# EAGLE design me433_2017 (EAGLE 8.1.0)
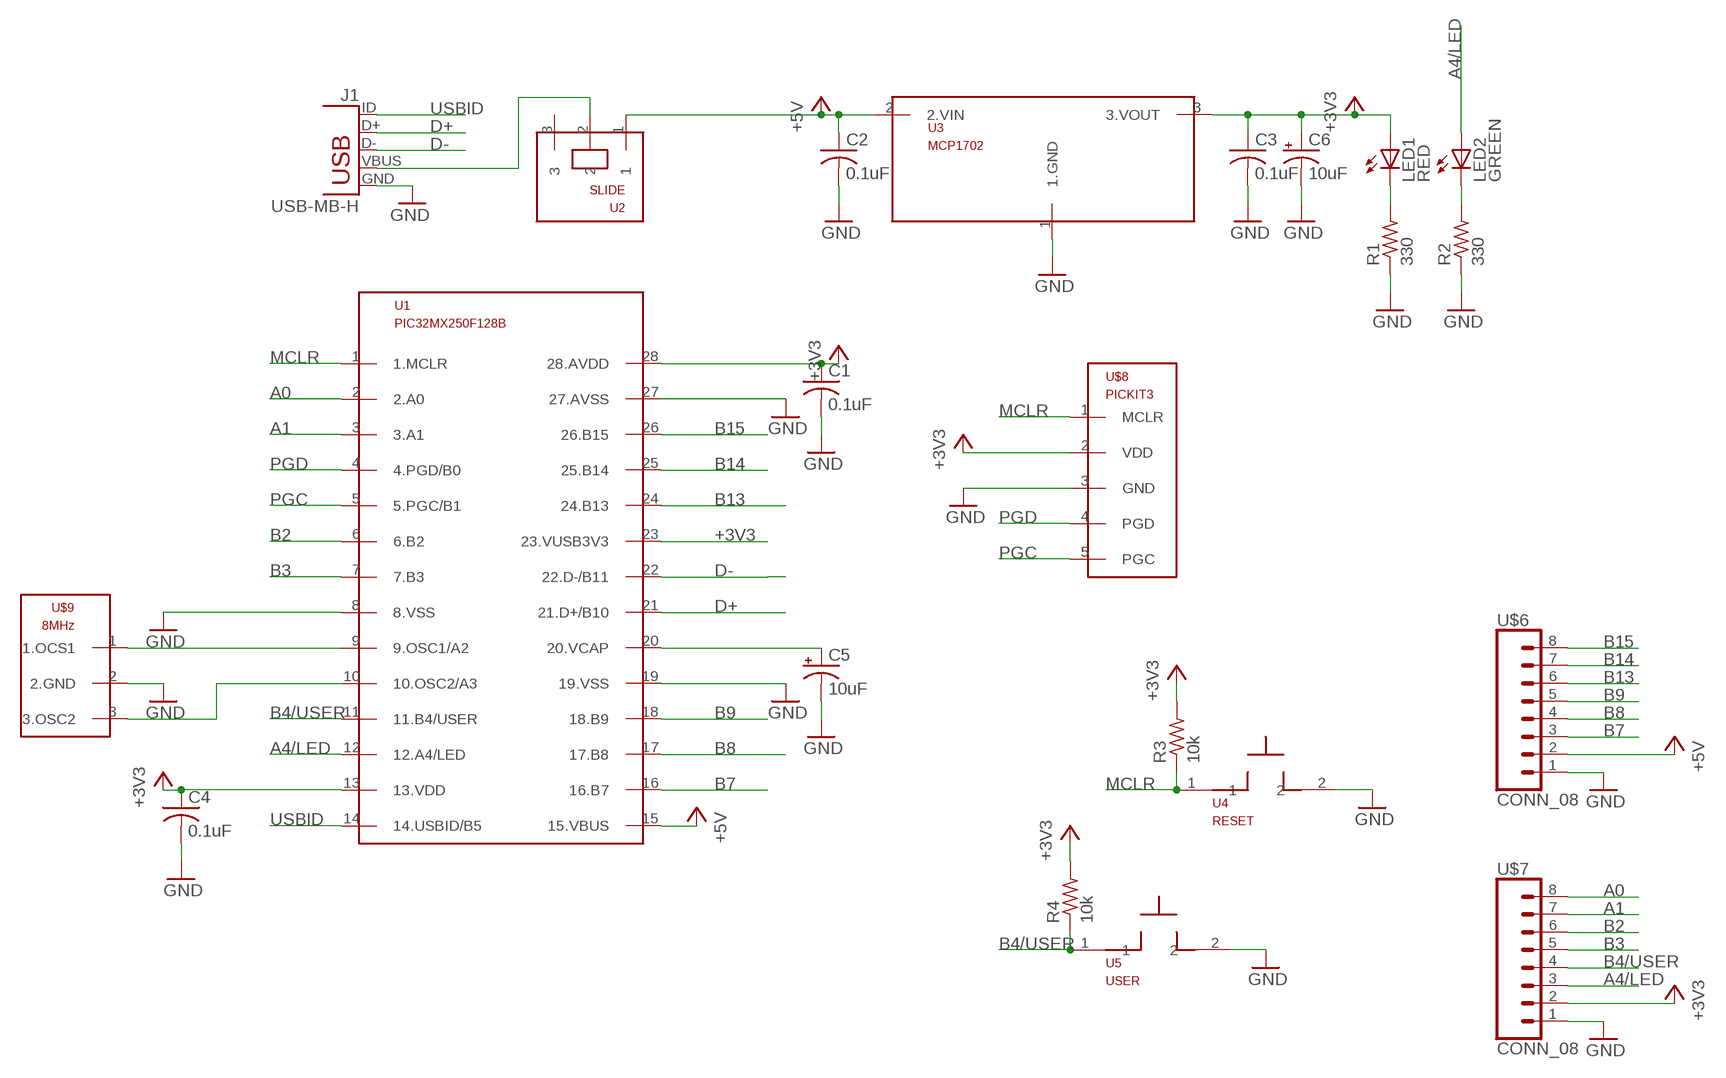
[diagram p0: schematic, sheet 1]

## Parts
C1  0.1uF  C-US025-025X050  [C025-025X050]
C2  0.1uF  C-US025-025X050  [C025-025X050]
C3  0.1uF  C-US025-025X050  [C025-025X050]
C4  0.1uF  C-US025-025X050  [C025-025X050]
C5  10uF  CPOL-USB45181B  [B45181B]
C6  10uF  CPOL-USB45181B  [B45181B]
J1  USB-MB-H  [USB-MB-H]
LED1  RED  LED3MM  [LED3MM]
LED2  GREEN  LED3MM  [LED3MM]
R1  330  R-US_0207/10  [0207/10]
R2  330  R-US_0207/10  [0207/10]
R3  10k  R-US_0207/10  [0207/10]
R4  10k  R-US_0207/10  [0207/10]
U1  PIC32MX250F128B  [DIL28-3]
U2  SLIDE  [SLIDE]
U3  MCP1702  [TO92]
U4  RESET  PB  [PB]
U5  USER  PB  [PB]
U$6  CONN_08  [1X08]
U$7  CONN_08  [1X08]
U$8  PICKIT3  [1X05]
U$9  8MHz  OSC  [OSC]

## Nets
+3V3: C1.1 C3.1 C4.1 C6.+ LED1.A R3.2 R4.2 U1.13(13.VDD) U1.23(23.VUSB3V3) U1.28(28.AVDD) U3.3(3.VOUT) U$7.2 U$8.2(VDD)
+5V: C2.1 U1.15(15.VBUS) U2.1 U3.2(2.VIN) U$6.2
A0: U1.2(2.A0) U$7.8
A1: U1.3(3.A1) U$7.7
A4/LED: LED2.A U1.12(12.A4/LED) U$7.3
B2: U1.6(6.B2) U$7.6
B3: U1.7(7.B3) U$7.5
B4/USER: R4.1 U1.11(11.B4/USER) U5.1 U$7.4
B7: U1.16(16.B7) U$6.3
B8: U1.17(17.B8) U$6.4
B9: U1.18(18.B9) U$6.5
B13: U1.24(24.B13) U$6.6
B14: U1.25(25.B14) U$6.7
B15: U1.26(26.B15) U$6.8
D+: J1.D+ U1.21(21.D+/B10)
D-: J1.D- U1.22(22.D-/B11)
GND: C1.2 C2.2 C3.2 C4.2 C5.- C6.- J1.GND R1.1 R2.1 U1.8(8.VSS) U1.19(19.VSS) U1.27(27.AVSS) U3.1(1.GND) U4.2 U5.2 U$6.1 U$7.1 U$8.3(GND) U$9.2(2.GND)
MCLR: R3.1 U1.1(1.MCLR) U4.1 U$8.1(MCLR)
N$1: J1.VBUS U2.2
N$2: U1.9(9.OSC1/A2) U$9.1(1.OCS1)
N$3: LED1.K(C) R1.2
N$4: LED2.K(C) R2.2
N$5: U1.10(10.OSC2/A3) U$9.3(3.OSC2)
N$6: C5.+ U1.20(20.VCAP)
PGC: U1.5(5.PGC/B1) U$8.5(PGC)
PGD: U1.4(4.PGD/B0) U$8.4(PGD)
USBID: J1.ID U1.14(14.USBID/B5)
Unconnected: U2.3

## Library data of the parts
C1-C4 = resistor:C-US: CAPACITOR, American symbol
C5 C6 = resistor:CPOL-US: POLARIZED CAPACITOR, American symbol
J1 = me433_2017:USB: USB Connectors USB-B-PTH is fully proven SKU : PRT-00139/CONN-08278 USB-miniB is fully proven SKU : PRT-00587 USB-A-PCB is untested. USB-A-H is throughly reviewed, but untested. Spark Fun Electronics SKU : PRT-00437 USB-B-SMT is throughly reviewed, but untested. Needs silkscreen touching up. USB-A-S has not been used/tested USB-MB-H has not been used/tested USB-MICROB has been used. CONN-09505
LED1 LED2 = led:LED: LED OSRAM: - CHIPLED LG R971, LG N971, LY N971, LG Q971, LY Q971, LO R971, LY R971 LH N974, LH R974 LS Q976, LO Q976, LY Q976 LO Q996 - Hyper CHIPLED LW Q18S LB Q993, LB Q99A, LB R99A - SideLED LS A670, LO A670, LY A670, LG A670, LP A670 LB A673, LV A673, LT A673, LW A673 LH A674 LY A675 LS A676, LA A676, LO A676, LY A676, LW A676 LS A679, LY A679, LG A679 - Hyper Micro SIDELED® LS Y876, LA Y876, LO Y876, LY Y876 LT Y87S - SmartLED LW L88C, LW L88S LB L89C, LB L89S, LG L890 LS L89K, LO L89K, LY L89K LS L896, LA L896, LO L896, LY L896 - TOPLED LS T670, LO T670, LY T670, LG T670, LP T670 LSG T670, LSP T670, LSY T670, LOP T670, LYG T670 LG T671, LOG T671, LSG T671 LB T673, LV T673, LT T673, LW T673 LH T674 LS T676, LA T676, LO T676, LY T676, LB T676, LH T676, LSB T676, LW T676 LB T67C, LV T67C, LT T67C, LS T67K, LO T67K, LY T67K, LW E67C LS E67B, LA E67B, LO E67B, LY E67B, LB E67C, LV E67C, LT E67C LW T67C LS T679, LY T679, LG T679 LS T770, LO T770, LY T770, LG T770, LP T770 LB T773, LV T773, LT T773, LW T773 LH T774 LS E675, LA E675, LY E675, LS T675 LS T776, LA T776, LO T776, LY T776, LB T776 LHGB T686 LT T68C, LB T68C - Hyper Mini TOPLED® LB M676 - Mini TOPLED Santana® LG M470 LS M47K, LO M47K, LY M47K Source: http://www.osram.convergy.de LUXEON: - LUMILED® LXK2-PW12-R00, LXK2-PW12-S00, LXK2-PW14-U00, LXK2-PW14-V00 LXK2-PM12-R00, LXK2-PM12-S00, LXK2-PM14-U00 LXK2-PE12-Q00, LXK2-PE12-R00, LXK2-PE12-S00, LXK2-PE14-T00, LXK2-PE14-U00 LXK2-PB12-K00, LXK2-PB12-L00, LXK2-PB12-M00, LXK2-PB14-N00, LXK2-PB14-P00, LXK2-PB14-Q00 LXK2-PR12-L00, LXK2-PR12-M00, LXK2-PR14-Q00, LXK2-PR14-R00 LXK2-PD12-Q00, LXK2-PD12-R00, LXK2-PD12-S00 LXK2-PH12-R00, LXK2-PH12-S00 LXK2-PL12-P00, LXK2-PL12-Q00, LXK2-PL12-R00 Source: www.luxeon.com KINGBRIGHT: KA-3528ASYC Source: www.kingbright.com
R1-R4 = resistor:R-US_: RESISTOR, American symbol
U1 = me433_2017:PIC32MX250F128B
U2 = me433_2017:SLIDE
U3 = me433_2017:MCP1702
U4 U5 = me433_2017:PB
U$6 U$7 = me433_2017:CONN_08
U$8 = me433_2017:PICKIT3
U$9 = me433_2017:OSC

## Board
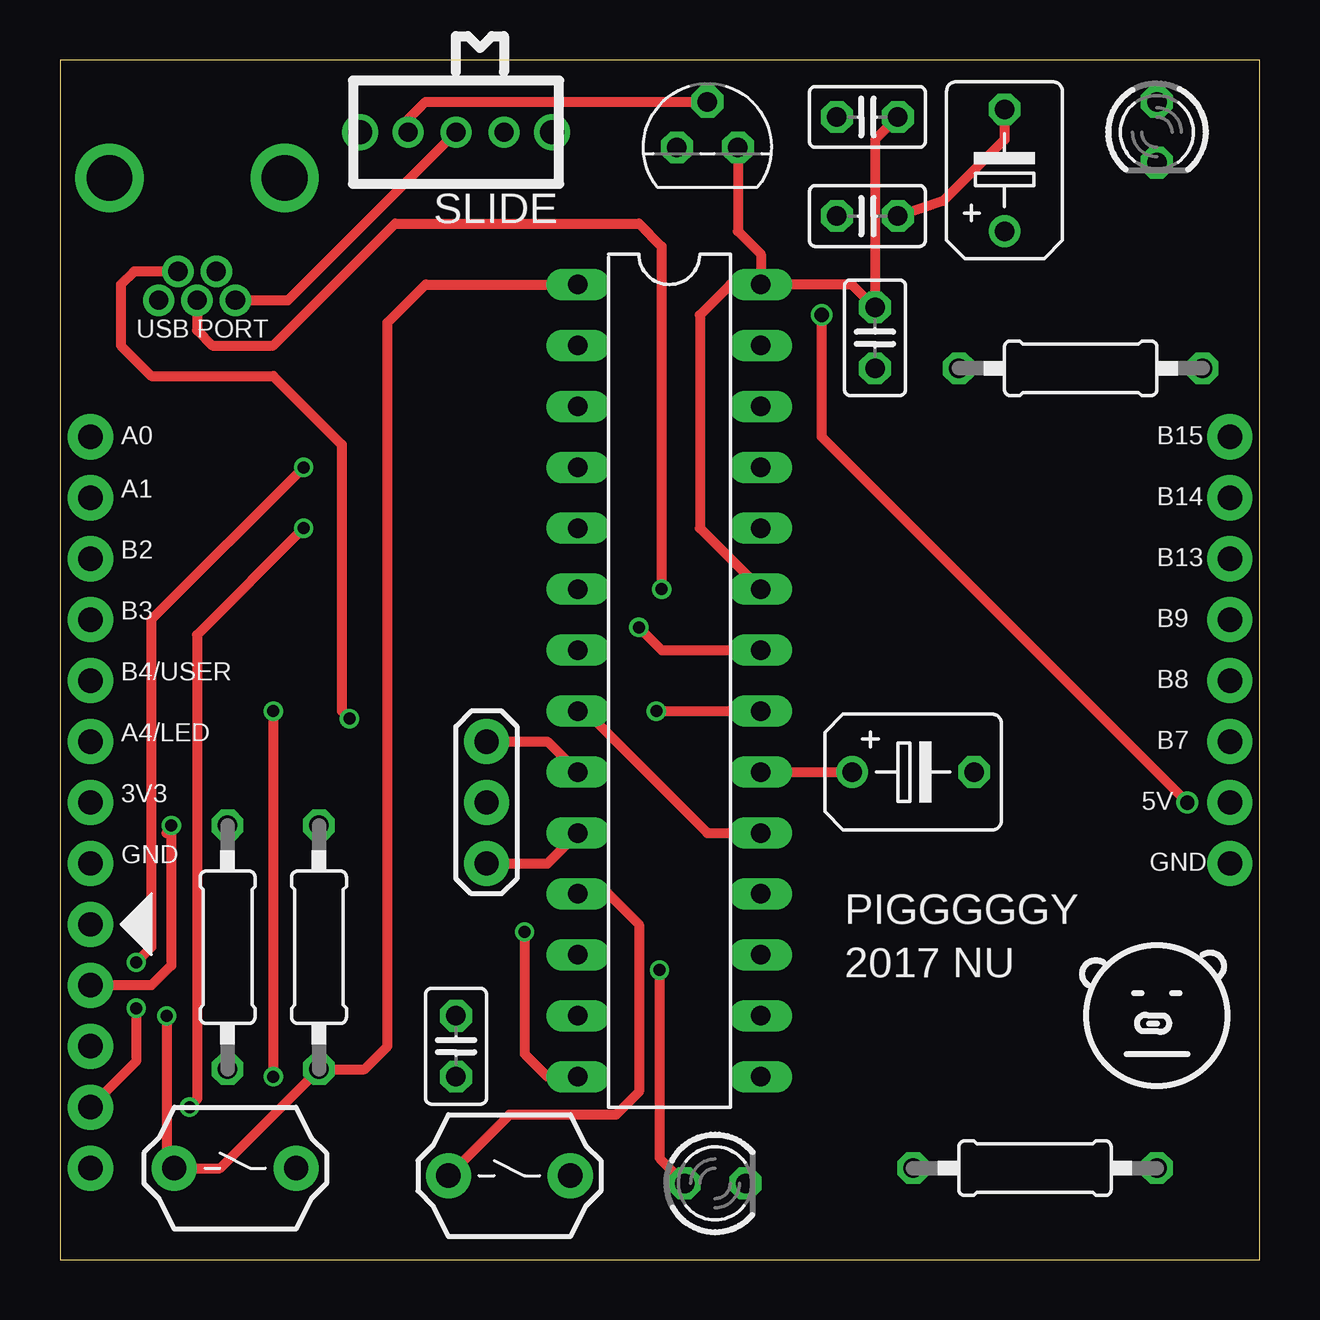
[diagram p1: board, top side]
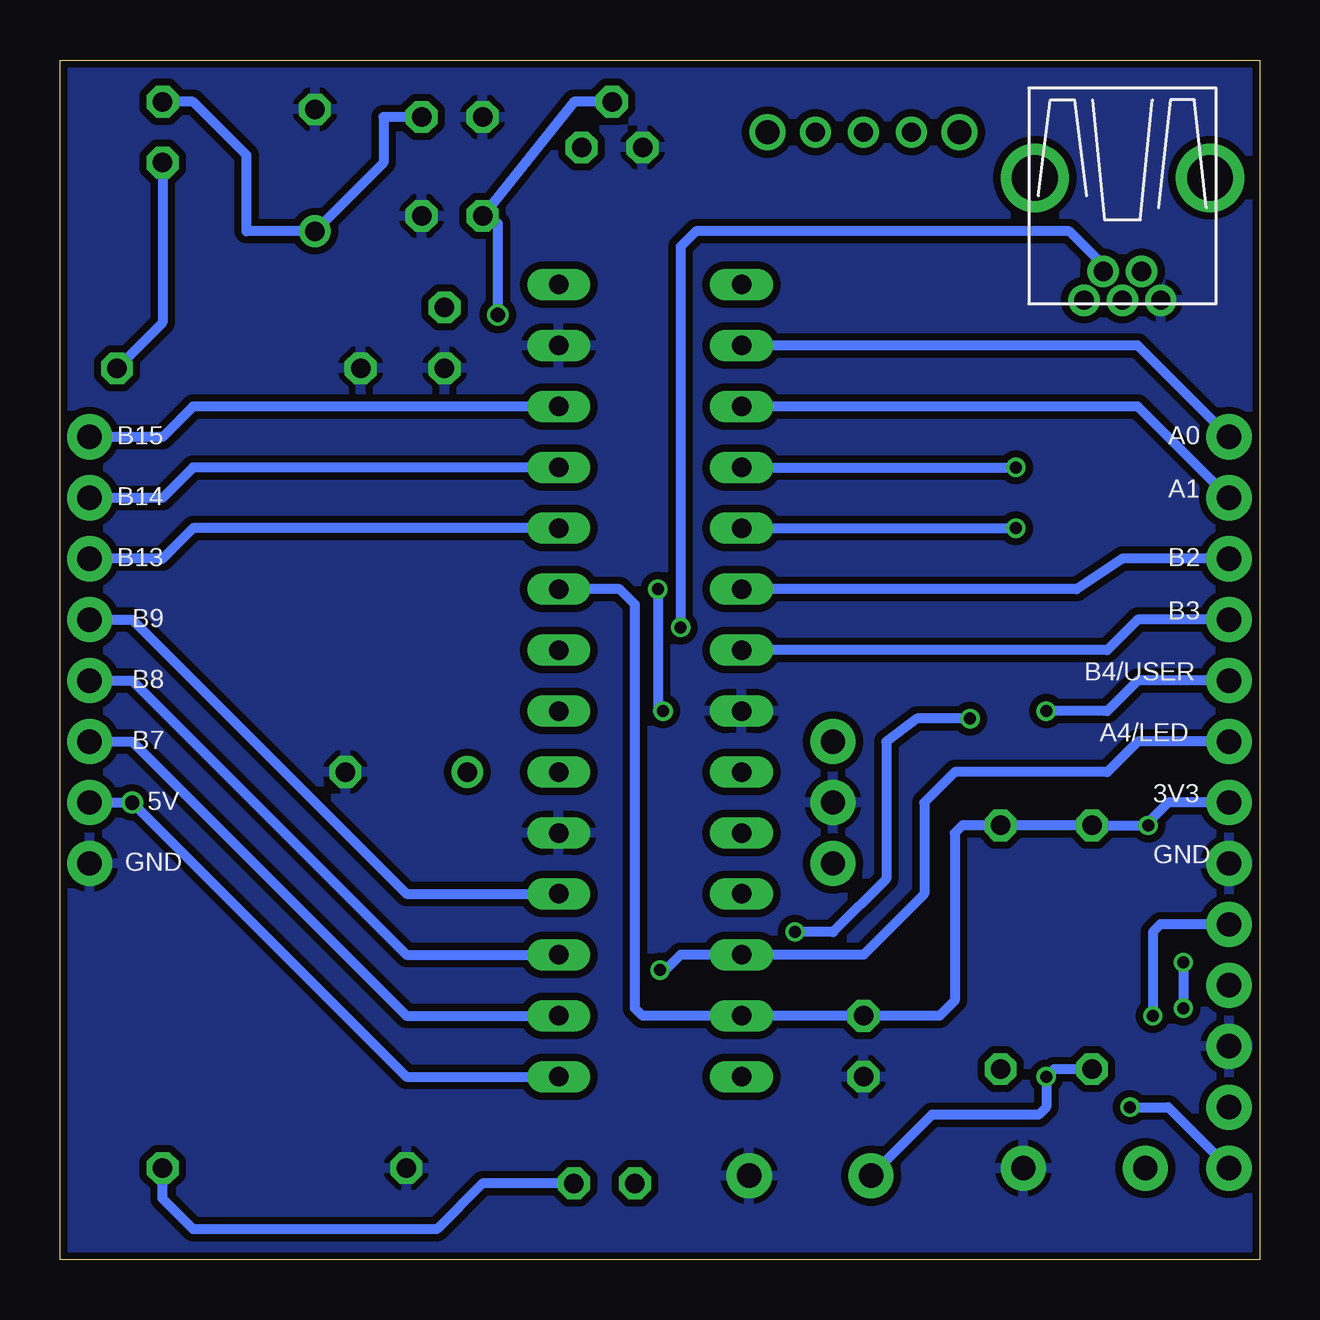
[diagram p2: board, bottom side, seen from below]

Size 50 x 50 mm. Coordinates in mm from the lower left corner, seen from the top.
Outline: 0,0 50,0 50,50 0,50 0,0
Copper layers (1*16): Top 0.035mm / dielectric 1.5mm / Bottom 0.035mm
Design rules "SeeedStudio_2layer_DRU_no_angle_20140221": minimum track width 6mil, minimum drill 12mil, track to track 6mil, track to pad 6mil, pad to pad 6mil, via to via 6mil, smd to smd 0mil, copper to edge 10mil, drill to drill 10mil, minimum pad ring 10mil, minimum via ring 6mil, stop-mask expansion 2mil, vias tented up to drill 100mil, thermal gap 10mil

### Footprints (pad centres in the part's own frame; a part is rotated, then mirrored left to right if it is on the bottom)
C025-025X050 = drill 0.813 octagon: 1 -1.27,0; 2 1.27,0
B45181B = drill 0.813: + -2.54,0 | drill 0.813 octagon: - 2.54,0
USB-MB-H = drill 0.8: D+ 5.1,0; D- 3.9,0.8; GND 5.1,-1.6; ID 3.9,-0.8; VBUS 5.1,1.6 | drill 1.9: P$6 0,-3.65; P$7 0,3.65
LED3MM = drill 0.813 octagon: A -1.27,0; K 1.27,0
0207/10 = drill 0.813 octagon: 1 -5.08,0; 2 5.08,0
DIL28-3 = drill 0.813 long: 1 -16.51,-3.81; 2 -13.97,-3.81; 3 -11.43,-3.81; 4 -8.89,-3.81; 5 -6.35,-3.81; 6 -3.81,-3.81; 7 -1.27,-3.81; 8 1.27,-3.81; 9 3.81,-3.81; 10 6.35,-3.81; 11 8.89,-3.81; 12 11.43,-3.81; 13 13.97,-3.81; 14 16.51,-3.81; 15 16.51,3.81; 16 13.97,3.81; 17 11.43,3.81; 18 8.89,3.81; 19 6.35,3.81; 20 3.81,3.81; 21 1.27,3.81; 22 -1.27,3.81; 23 -3.81,3.81; 24 -6.35,3.81; 25 -8.89,3.81; 26 -11.43,3.81; 27 -13.97,3.81; 28 -16.51,3.81
SLIDE = drill 0.8: 1 -2,0; 2 0,0; 3 2,0 | drill 1: P$1 -4,0; P$2 4,0
TO92 = drill 0.813 octagon: 1 -1.27,0; 2 0,1.905; 3 1.27,0
PB = drill 1.016 pad 1.88: 1 -2.54,0; 2 2.54,0
1X08 = drill 1.016 pad 1.88: 1 0,0; 2 2.54,0; 3 5.08,0; 4 7.62,0; 5 10.16,0; 6 12.7,0; 7 15.24,0; 8 17.78,0
1X05 = drill 1.016 pad 1.88: 1 0,0; 2 2.54,0; 3 5.08,0; 4 7.62,0; 5 10.16,0
OSC = drill 1.016 pad 1.88: 1 -2.54,0; 2 0,0; 3 2.54,0

### Placement (x,y rotation side)
C1  33.97,38.42 270 top
C2  33.66,43.5 0 top
C3  33.66,47.62 180 top
C4  16.51,8.89 270 top
C5  35.56,20.32 0 top
C6  39.37,45.4 90 top
J1  5.71,45.09 270 top
LED1  45.72,46.99 270 top
LED2  27.3,3.17 0 top
R1  42.55,37.15 0 top
R2  40.64,3.81 0 top
R3  10.79,13.02 90 top
R4  6.99,13.02 90 top
U1  25.4,24.13 270 top
U2  16.51,46.99 0 top
U3  26.99,46.35 0 top
U4  7.3,3.81 0 top
U5  18.73,3.49 0 top
U$6  48.77,16.51 90 top
U$7  1.27,16.51 90 top
U$8  1.27,13.97 270 top
U$9  17.78,19.05 270 top

### Tracks (layer width: path | path; a pad name or v marks a point on that pad's centre or on a via)
+3V3  (via drill 0.5)
  Top 0.406: U3.3 28.26,42.86 29.21,41.91 U1.28 | U1.28 33.02,40.64 C1.1 33.97,46.67 C3.1 | U1.28 27.94,40.64 26.67,39.37 26.67,30.48 U1.23 | 4.45,17.78 4.76,18.1 v4.64,18.1 4.64,12.26 3.81,11.43 U$8.2
  Bottom 0.406: U$7.2 3.81,19.05 4.76,18.1 | 4.76,18.1 R4.2 R3.2 12.38,18.1 12.7,17.78 12.7,10.79 13.34,10.16 C4.1 U1.13 25.72,10.16 26.04,10.48 26.04,27.3 26.67,27.94 U1.23 | C3.1 36.51,47.62 36.51,45.72 C6.+ 42.23,42.86 42.23,46.04 44.45,48.26 LED1.A | v4.64,18.1 4.76,18.1
+5V  (via drill 0.6)
  Top 0.406: U2.1 14.51,47.53 15.24,48.26 U3.2 | v46.99,19.05 31.75,34.29 v31.75,39.37
  Bottom 0.406: U1.15 35.56,7.62 v46.99,19.05 U$6.2 | v31.75,39.37 31.75,43.18 C2.1 28.57,48.26 U3.2
A0
  Bottom 0.406: U$7.8 5.08,38.1 U1.2
A1
  Bottom 0.406: U$7.7 5.08,35.56 U1.3
A4/LED  (via drill 0.5)
  Top 0.406: v24.99,12.06 24.99,4.22 LED2.A
  Bottom 0.406: U$7.3 5.08,21.59 6.35,20.32 12.7,20.32 13.97,19.05 13.97,15.24 16.51,12.7 U1.12 24.13,12.7 24.77,12.06 v24.99,12.06
B2
  Bottom 0.406: U$7.6 5.71,29.21 7.62,27.94 U1.6
B3
  Bottom 0.406: U$7.5 5.08,26.67 6.35,25.4 U1.7
B4/USER  (via drill 0.5)
  Top 0.406: U1.11 22.86,15.24 24.13,13.97 24.13,6.99 23.18,6.03 18.73,6.03 U5.1 | v8.89,22.86 v8.89,7.62
  Bottom 0.406: R4.1 8.57,7.94 v8.89,7.62 8.89,6.35 9.21,6.03 13.65,6.03 U5.1 | U$7.4 5.08,24.13 6.35,22.86 v8.89,22.86
B7
  Bottom 0.406: U$6.3 46.99,21.59 35.56,10.16 U1.16
B8
  Bottom 0.406: U$6.4 46.99,24.13 35.56,12.7 U1.17
B9
  Bottom 0.406: U$6.5 46.99,26.67 35.56,15.24 U1.18
B13
  Bottom 0.406: U1.24 44.45,30.48 45.72,29.21 U$6.6
B14
  Bottom 0.406: U1.25 44.45,33.02 45.72,31.75 U$6.7
B15
  Bottom 0.406: U1.26 44.45,35.56 45.72,34.29 U$6.8
D+  (via drill 0.5)
  Top 0.406: J1.D+ 5.71,38.73 6.35,38.1 8.89,38.1 13.97,43.18 24.13,43.18 25.08,42.23 v25.08,27.94 | v24.86,22.86 U1.21
  Bottom 0.406: v25.08,27.94 25.08,22.86 v24.86,22.86
D-  (via drill 0.5)
  Top 0.406: v24.13,26.35 25.08,25.4 U1.22
  Bottom 0.406: J1.D- 6.51,41.44 7.94,42.86 23.5,42.86 24.13,42.23 v24.13,26.35
GND
  Top 0.406: U1.8 21.91,22.86 26.99,17.78 U1.19 | C6.- 39.37,46.67 36.83,44.13 C2.2
  pour Bottom (isolate 0.305): 0.32,49.85 0.32,0 49.85,0 49.85,0.32 49.85,49.85
MCLR  (via drill 0.5)
  Top 0.406: U1.1 15.24,40.64 13.65,39.05 13.65,8.89 12.7,7.94 R3.1 6.67,3.81 U4.1 4.45,4.13 v4.45,10.16
  Bottom 0.406: U$8.1 4.13,13.97 4.45,13.65 v4.45,10.16
N$1
  Top 0.406: J1.VBUS 9.51,39.98 U2.2
N$2
  Top 0.406: U$9.1 20.32,21.59 U1.9
N$3
  Bottom 0.406: LED1.K 45.72,39.05 R1.2
N$4
  Bottom 0.406: LED2.K 32.38,3.17 34.29,1.27 44.45,1.27 45.72,2.54 R2.2
N$5
  Top 0.406: U$9.3 20.32,16.51 U1.10
N$6
  Top 0.406: U1.20 C5.+
PGC  (via drill 0.5)
  Top 0.406: v10.16,30.48 5.71,26.04 5.71,6.67 v5.4,6.35
  Bottom 0.406: U1.5 v10.16,30.48 | U$8.5 3.81,6.35 v5.4,6.35
PGD  (via drill 0.5)
  Top 0.406: v10.16,33.02 3.81,26.67 3.81,13.02 v3.17,12.38 | v3.17,10.48 3.17,8.26 U$8.4
  Bottom 0.406: U1.4 v10.16,33.02 | v3.17,12.38 v3.17,10.48
USBID  (via drill 0.5)
  Top 0.406: J1.ID 3.08,41.19 2.54,40.64 2.54,38.1 3.81,36.83 8.89,36.83 11.75,33.97 11.75,22.86 v12.06,22.54 | v19.37,13.65 19.37,8.57 20.32,7.62 U1.14
  Bottom 0.406: v12.06,22.54 14.29,22.54 15.56,21.59 15.56,15.88 17.78,13.65 v19.37,13.65

### Text on the board
tPlace: USB PORT | A0 | B15 | A1 | B14 | B2 | B13 | B3 | B9 | B4/USER | B8 | A4/LED | B7 | 3V3 | 5V | GND | GND | PIGGGGGY | 2017 NU
bPlace: A0 | B15 | A1 | B14 | B2 | B13 | B3 | B9 | B4/USER | B8 | A4/LED | B7 | 3V3 | 5V | GND | GND